# EAGLE schematic TechLab_Cape (EAGLE 7.7.0)
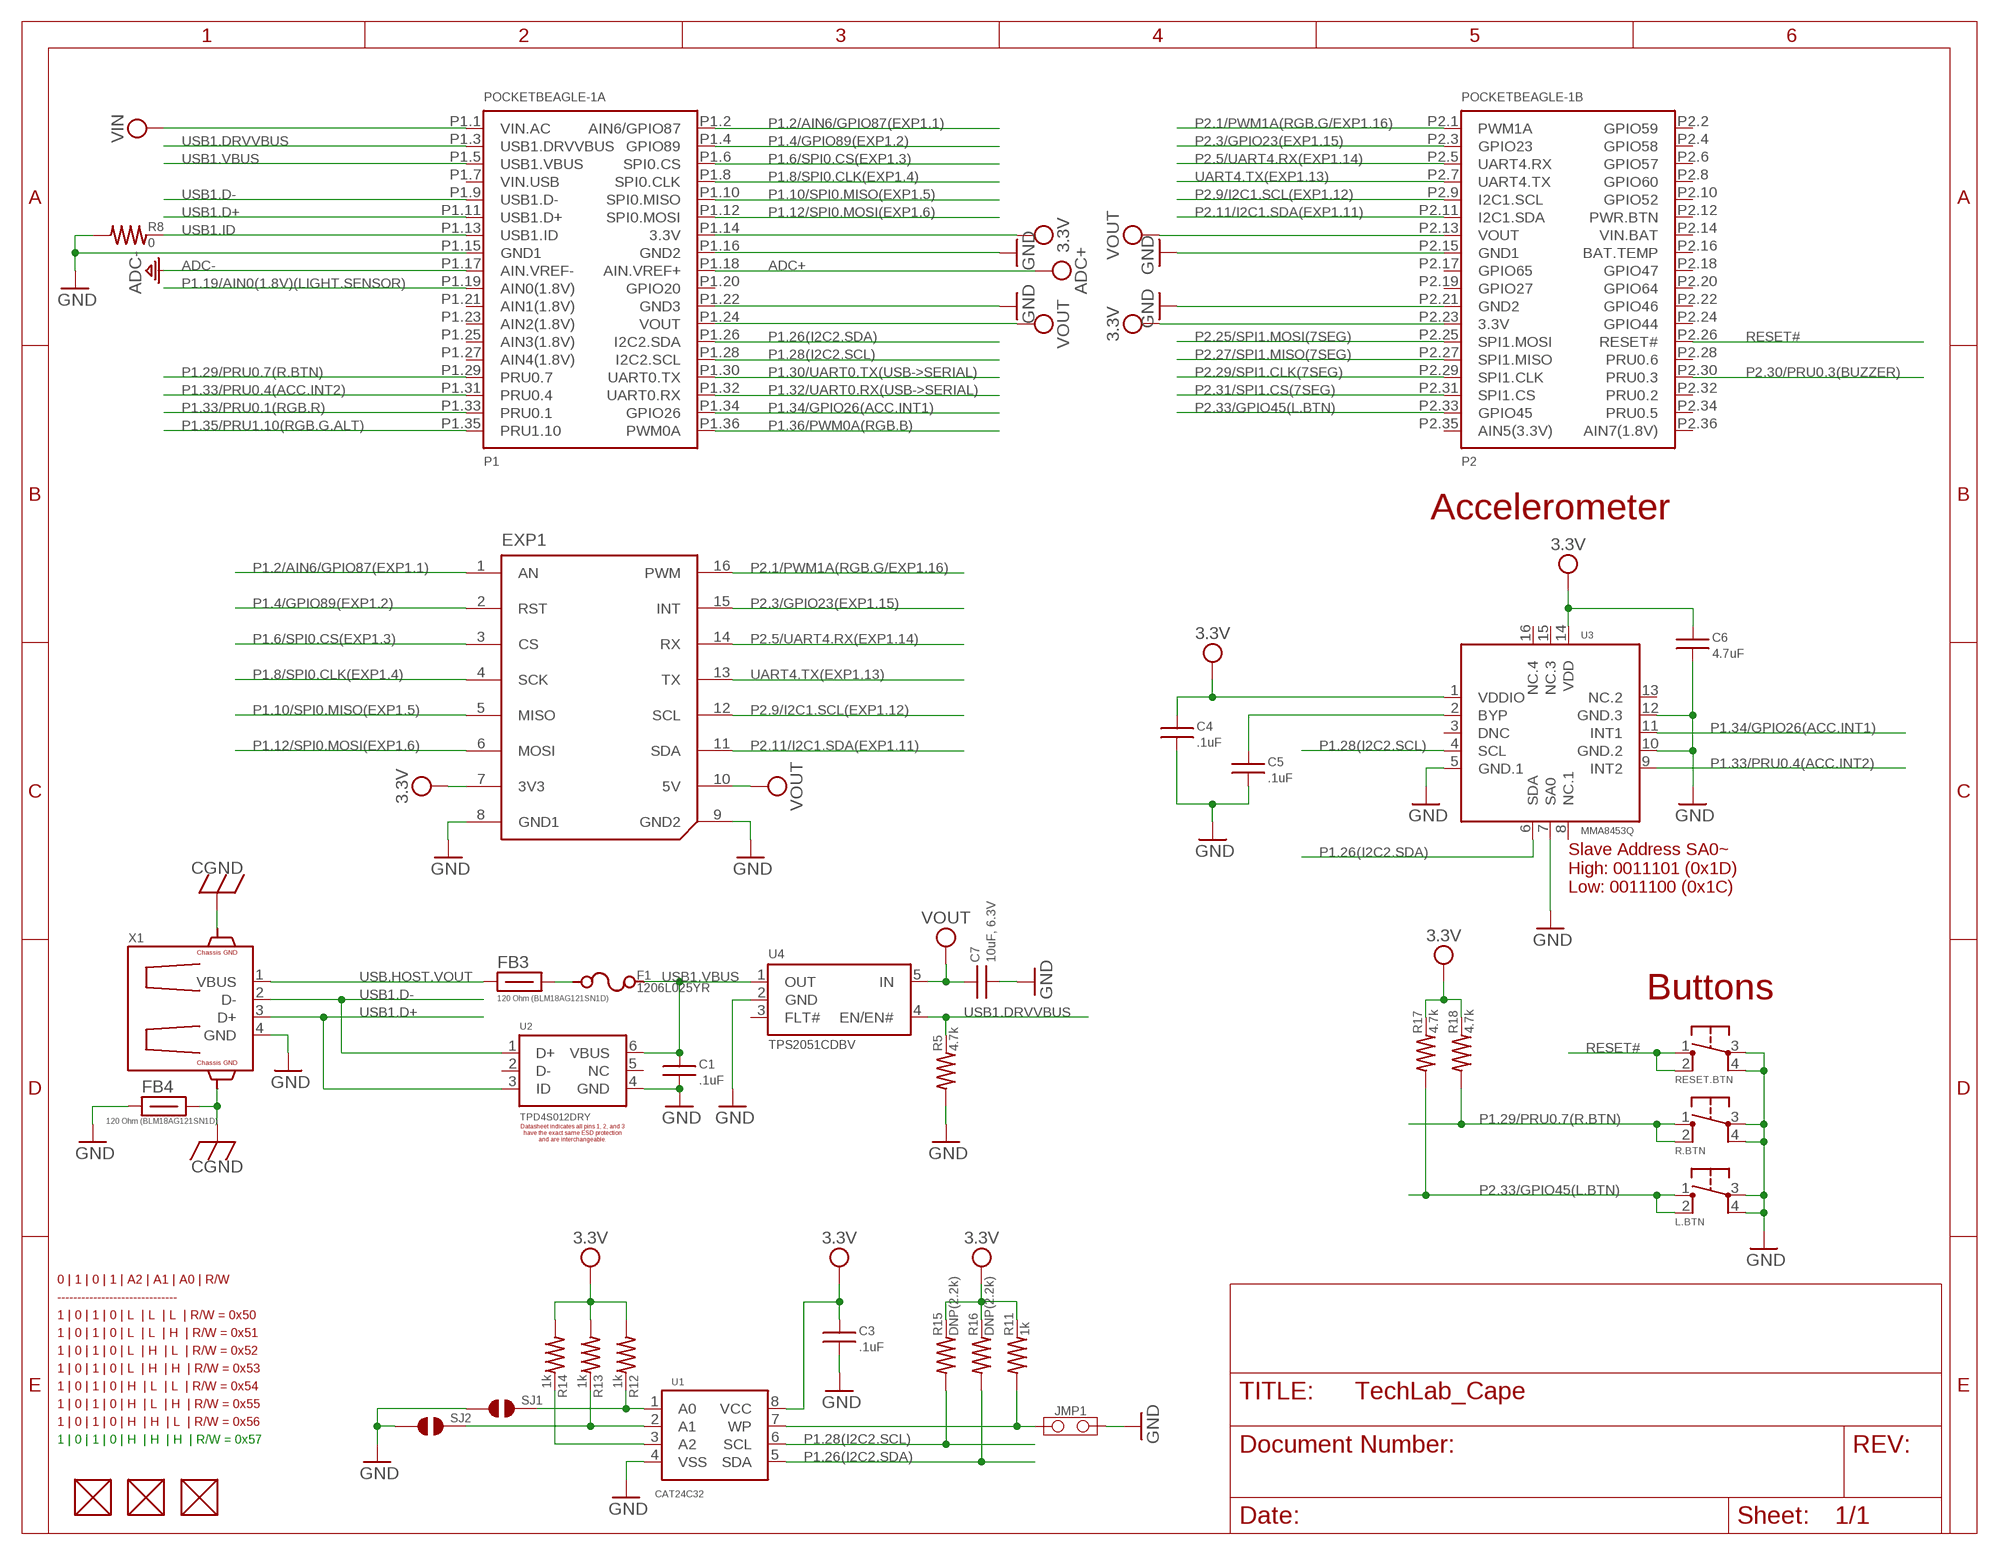
[diagram p0: schematic, sheet 1, part 1 of 2]
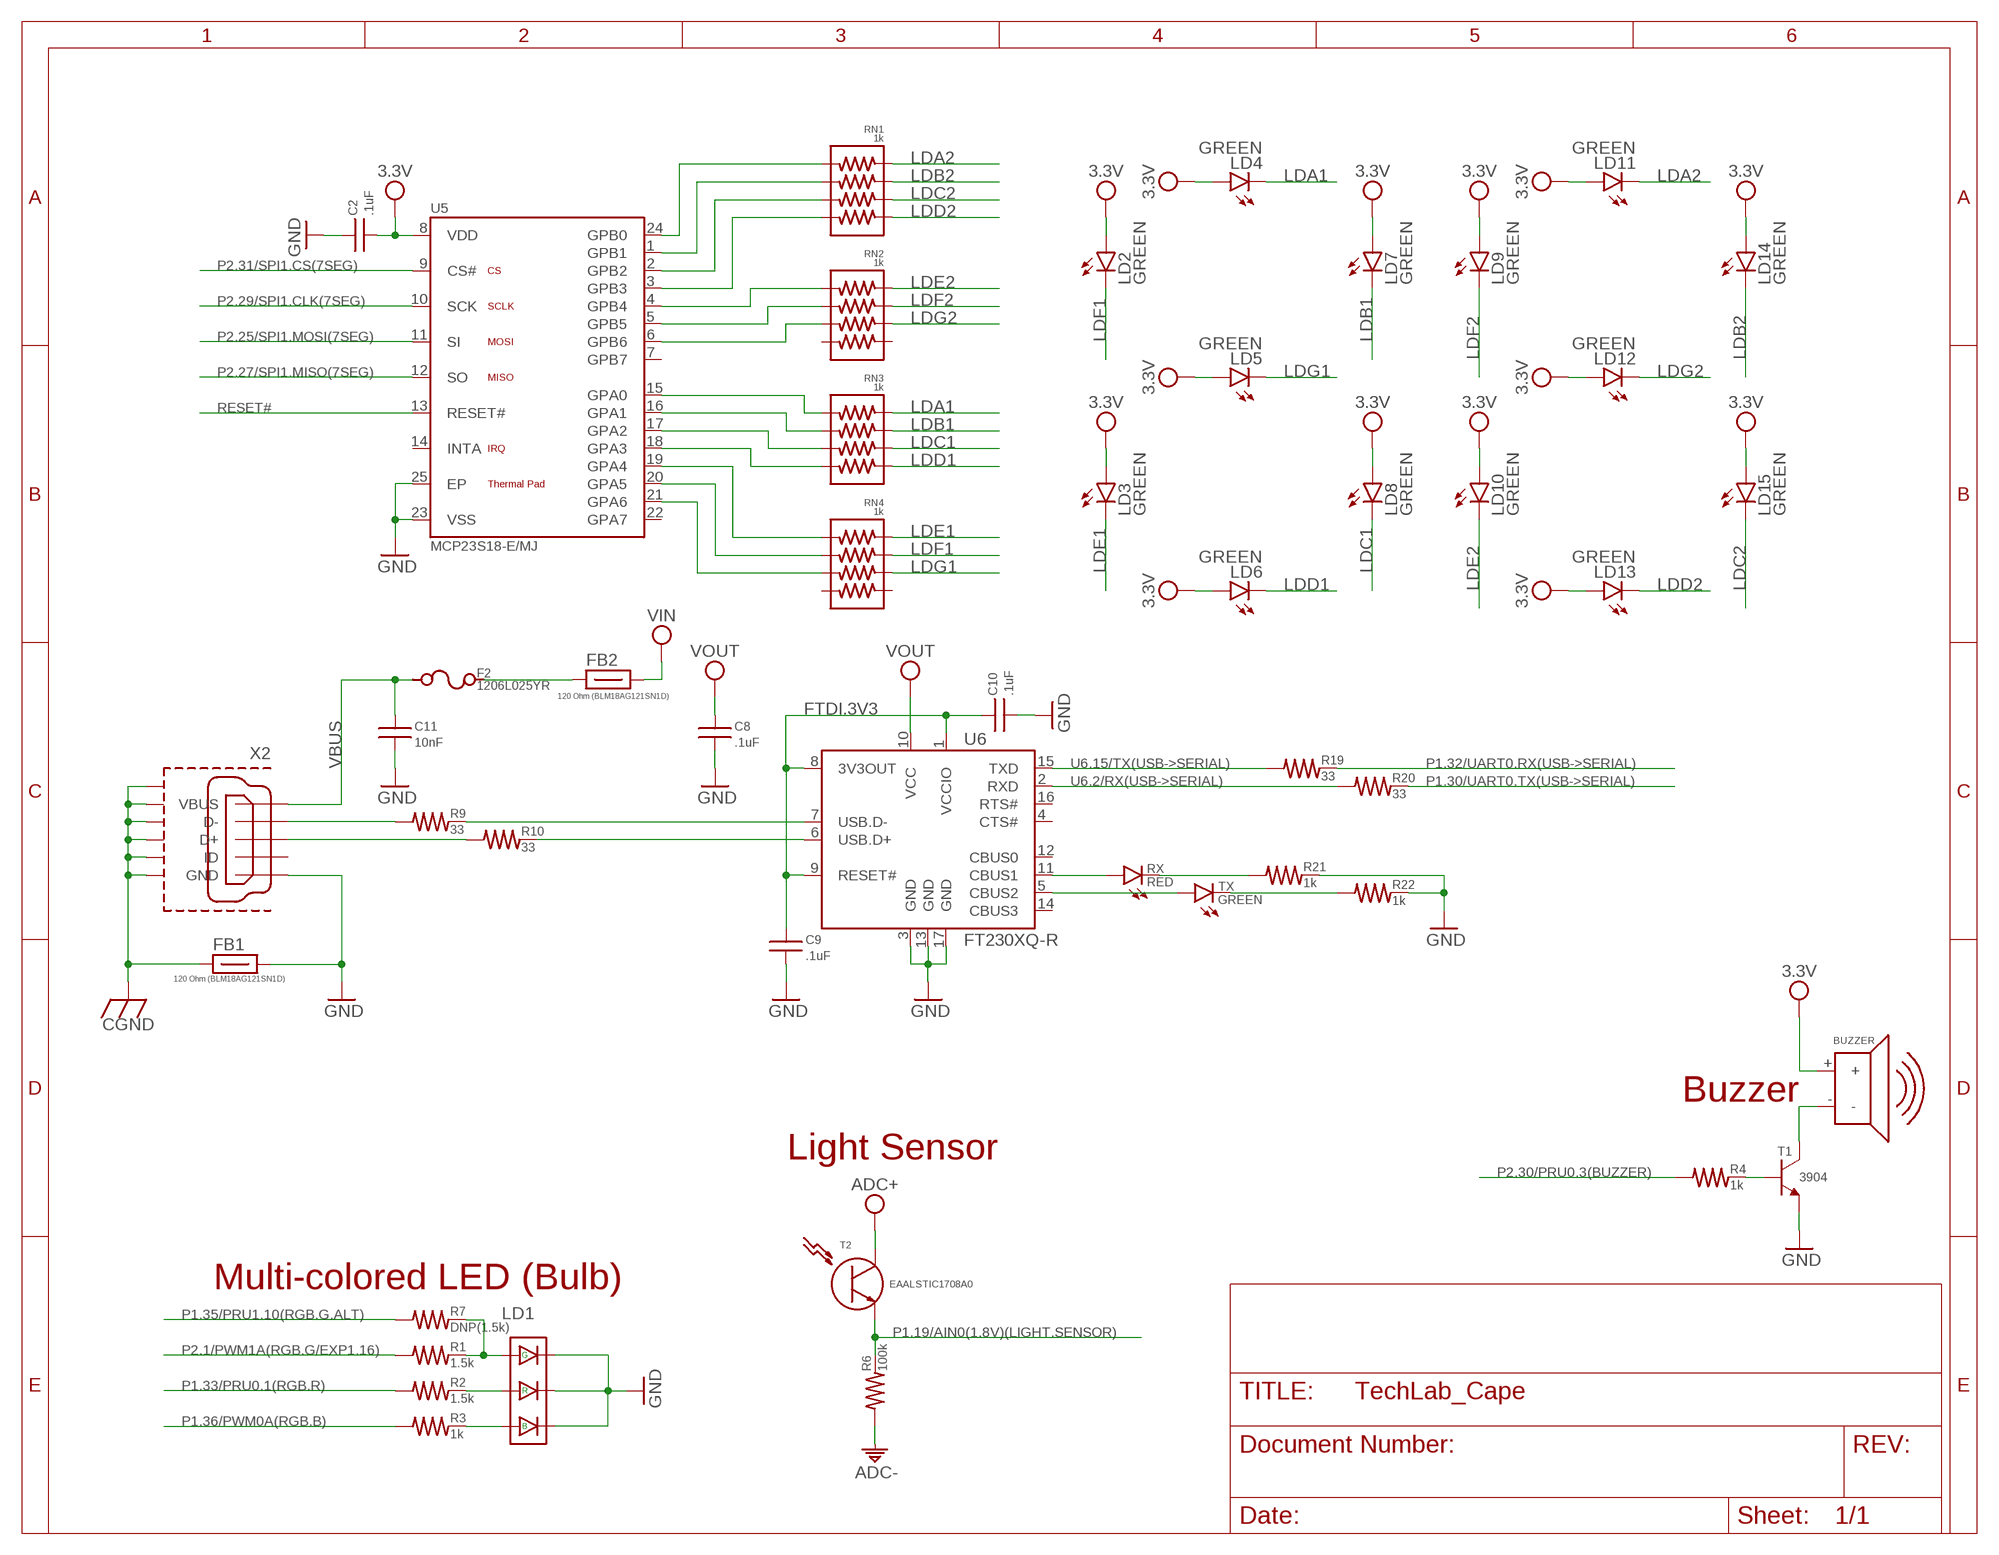
[diagram p1: schematic, sheet 1, part 2 of 2]

## Parts
BUZZER  SMD-140035H  [SMD-140035H]
C1  .1uF  CAPACITOR-(INCH)-0402  [0402]
C2  .1uF  CAPACITOR-(INCH)-0402  [0402]
C3  .1uF  CAPACITOR-(INCH)-0402  [0402]
C4  .1uF  CAPACITOR-(INCH)-0402  [0402]
C5  .1uF  CAPACITOR-(INCH)-0402  [0402]
C6  4.7uF  CAPACITOR-(INCH)-0402  [0402]
C7  10uF, 6.3V  CAPACITOR-(INCH)-0805  [0805]
C8  .1uF  CAPACITOR-(INCH)-0402  [0402]
C9  .1uF  CAPACITOR-(INCH)-0402  [0402]
C10  .1uF  CAPACITOR-(INCH)-0402  [0402]
C11  10nF  CAPACITOR-(INCH)-0402  [0402]
EXP1  PARALLEL-8PIN-0.9INCH_PITCH-SMT_GP  [PARALLEL-8PIN-0.9INCH_PITCH-SMT_GP]
F1  1206L025YR  FUSE-(INCH)-1206  [1206]
F2  1206L025YR  FUSE-(INCH)-1206  [1206]
FB1  120 Ohm (BLM18AG121SN1D)  FB-(INCH)-0603  [0603]
FB2  120 Ohm (BLM18AG121SN1D)  FB-(INCH)-0603  [0603]
FB3  120 Ohm (BLM18AG121SN1D)  FB-(INCH)-0603  [0603]
FB4  120 Ohm (BLM18AG121SN1D)  FB-(INCH)-0603  [0603]
FUD1  FIDUCIAL  [FIDUCIAL_40MIL]
FUD2  FIDUCIAL  [FIDUCIAL_40MIL]
FUD3  FIDUCIAL  [FIDUCIAL_40MIL]
JMP1  JUMPER-(X2)  [JUMPER-(X2)]
L.BTN  TACTILE.SWITCH-6MM  [6MM_TACTILE-SWITCH]
LD1  JNS-5050RGB  [LED_RGB_5050]
LD2  GREEN  LED-(INCH)-0805  [0805-LED]
LD3  GREEN  LED-(INCH)-0805  [0805-LED]
LD4  GREEN  LED-(INCH)-0805  [0805-LED]
LD5  GREEN  LED-(INCH)-0805  [0805-LED]
LD6  GREEN  LED-(INCH)-0805  [0805-LED]
LD7  GREEN  LED-(INCH)-0805  [0805-LED]
LD8  GREEN  LED-(INCH)-0805  [0805-LED]
LD9  GREEN  LED-(INCH)-0805  [0805-LED]
LD10  GREEN  LED-(INCH)-0805  [0805-LED]
LD11  GREEN  LED-(INCH)-0805  [0805-LED]
LD12  GREEN  LED-(INCH)-0805  [0805-LED]
LD13  GREEN  LED-(INCH)-0805  [0805-LED]
LD14  GREEN  LED-(INCH)-0805  [0805-LED]
LD15  GREEN  LED-(INCH)-0805  [0805-LED]
POCKETBEAGLE-1  POCKETBEAGLE-(ORIGIN-CENTER)-SMT.PADS(ONLY)-NO.RESTRICT  [POCKETBEAGLE-(ORIGIN-CENTER)-SMT.PADS(ONLY)-NO.RESTRICT]
R1  1.5k  RESISTOR-(INCH)-0402  [0402]
R2  1.5k  RESISTOR-(INCH)-0402  [0402]
R3  1k  RESISTOR-(INCH)-0402  [0402]
R4  1k  RESISTOR-(INCH)-0402  [0402]
R5  4.7k  RESISTOR-(INCH)-0402  [0402]
R6  100k  RESISTOR-(INCH)-0402  [0402]
R7  DNP(1.5k)  RESISTOR-(INCH)-0402  [0402]
R8  0  RESISTOR-(INCH)-0402  [0402]
R9  33  RESISTOR-(INCH)-0402  [0402]
R10  33  RESISTOR-(INCH)-0402  [0402]
R11  1k  RESISTOR-(INCH)-0402  [0402]
R12  1k  RESISTOR-(INCH)-0402  [0402]
R13  1k  RESISTOR-(INCH)-0402  [0402]
R14  1k  RESISTOR-(INCH)-0402  [0402]
R15  DNP(2.2k)  RESISTOR-(INCH)-0402  [0402]
R16  DNP(2.2k)  RESISTOR-(INCH)-0402  [0402]
R17  4.7k  RESISTOR-(INCH)-0402  [0402]
R18  4.7k  RESISTOR-(INCH)-0402  [0402]
R19  33  RESISTOR-(INCH)-0402  [0402]
R20  33  RESISTOR-(INCH)-0402  [0402]
R21  1k  RESISTOR-(INCH)-0402  [0402]
R22  1k  RESISTOR-(INCH)-0402  [0402]
R.BTN  TACTILE.SWITCH-6MM  [6MM_TACTILE-SWITCH]
RESET.BTN  TACTILE.SWITCH-3X3.5MM  [3X3.5MM-TACTILE-SWITCH]
RN1  1k  RESISTOR.NETWORK-(4)  [RN0804]
RN2  1k  RESISTOR.NETWORK-(4)  [RN0804]
RN3  1k  RESISTOR.NETWORK-(4)  [RN0804]
RN4  1k  RESISTOR.NETWORK-(4)  [RN0804]
RX  RED  LED-(INCH)-0805  [0805-LED]
SJ1  SOLDER.JOINT-(INCH)-0402  [SOLDER.JOINT(0402)]
SJ2  SOLDER.JOINT-(INCH)-0402  [SOLDER.JOINT(0402)]
T1  3904  NPN.BIPOLAR-(SOT23)  [SOT23]
T2  EAALSTIC1708A0  [EAALSTIC1708A0]
TX  GREEN  LED-(INCH)-0805  [0805-LED]
U1  CAT24C32  [UDFN8,2X3(ON-SEMI)]
U2  TPD4S012DRY  TPD4S012DRYR  [SON-6(TI)-DRY]
U3  MMA8453Q  [QFN-16-(MMA8453Q)]
U4  TPS2051CDBV  [SOT23-5(TI-DBV)]
U5  MCP23S18-E/MJ  MCP23S18  [QFN24-MJ-0.5-4X4MM]
U6  FT230XQ-R  FT230XQ  [QFN16-0.65-4X4MM]
X1  292303-1  [292303-1]
X2  10118192-0001LF  [10118192-0001LF(MICRO-USB-B-AMPHENOL-FCI)]

## Nets
3.3V: BUZZER.+ C2.2 C3.1 C4.1 C6.1 EXP1.7(3V3) LD2.A LD3.A LD4.A LD5.A LD6.A LD7.A LD8.A LD9.A LD10.A LD11.A LD12.A LD13.A LD14.A LD15.A POCKETBEAGLE-1.P1.14(A:3.3V) POCKETBEAGLE-1.P2.23(B:3.3V) R11.2 R12.1 R13.1 R14.1 R15.2 R16.2 R17.2 R18.2 U1.8(VCC) U3.1(VDDIO) U3.14(VDD) U5.8(VDD)
A0: R12.2 SJ1.2 U1.1(A0)
A1: R13.2 SJ2.2 U1.2(A1)
A2: R14.2 U1.3(A2)
ADC+: POCKETBEAGLE-1.P1.18(A:AIN.VREF+) T2.1(C)
ADC-: POCKETBEAGLE-1.P1.17(A:AIN.VREF-) R6.1
CGND: FB1.1 FB4.2 X1.C1(CG) X1.C2(CG) X2.CGND1(SGND1) X2.CGND2(SGND2) X2.CGND3(SGND3) X2.CGND4(SGND4) X2.CGND5(SGND5) X2.CGND6(SGND6)
F2-FB2: F2.2 FB2.1
FB4-F1: F1.1 FB3.2
FTDI.3V3: C9.1 C10.1 U6.1(VCCIO) U6.8(3V3OUT) U6.9(RESET#)
GND: C1.2 C2.1 C3.2 C4.2 C5.2 C6.2 C7.2 C8.2 C9.2 C10.2 C11.2 EXP1.8(GND1) EXP1.9(GND2) FB1.2 FB4.1 JMP1.2 L.BTN.3 L.BTN.4 LD1.4(-) LD1.5(-) LD1.6(-) POCKETBEAGLE-1.P1.15(A:GND1) POCKETBEAGLE-1.P1.16(A:GND2) POCKETBEAGLE-1.P1.22(A:GND3) POCKETBEAGLE-1.P2.15(B:GND1) POCKETBEAGLE-1.P2.21(B:GND2) R5.1 R8.1 R21.2 R22.2 R.BTN.3 R.BTN.4 RESET.BTN.3 RESET.BTN.4 SJ1.1 SJ2.1 T1.2(E) U1.4(VSS) U2.4(GND) U3.5(GND.1) U3.7(SA0) U3.10(GND.2) U3.12(GND.3) U4.2(GND) U5.23(VSS) U5.25(EP) U6.3(GND) U6.13(GND) U6.17(GND) X1.4(GND) X2.GND
GPA0: RN3.8 U5.15(GPA0)
GPA1: RN3.7 U5.16(GPA1)
GPA2: RN3.6 U5.17(GPA2)
GPA3: RN3.5 U5.18(GPA3)
GPA4: RN4.8 U5.19(GPA4)
GPA5: RN4.7 U5.20(GPA5)
GPA6: RN4.6 U5.21(GPA6)
GPB0: RN1.8 U5.24(GPB0)
GPB1: RN1.7 U5.1(GPB1)
GPB2: RN1.6 U5.2(GPB2)
GPB3: RN1.5 U5.3(GPB3)
GPB4: RN2.8 U5.4(GPB4)
GPB5: RN2.7 U5.5(GPB5)
GPB6: RN2.6 U5.6(GPB6)
LDA1: LD4.K RN3.1
LDA2: LD11.K RN1.1
LDB1: LD7.K RN3.2
LDB2: LD14.K RN1.2
LDC1: LD8.K RN3.3
LDC2: LD15.K RN1.3
LDD1: LD6.K RN3.4
LDD2: LD13.K RN1.4
LDE1: LD3.K RN4.1
LDE2: LD10.K RN2.1
LDF1: LD2.K RN4.2
LDF2: LD9.K RN2.2
LDG1: LD5.K RN4.3
LDG2: LD12.K RN2.3
LED.BLUE: LD1.1(+) R3.2
LED.GREEN: LD1.3(+) R1.2 R7.2
LED.RED: LD1.2(+) R2.2
N$5: BUZZER.- T1.3(C)
N$10: C5.1 U3.2(BYP)
N$51: R4.2 T1.1(B)
P1.2/AIN6/GPIO87(EXP1.1): EXP1.1(AN) POCKETBEAGLE-1.P1.2(A:AIN6/GPIO87)
P1.4/GPIO89(EXP1.2): EXP1.2(RST) POCKETBEAGLE-1.P1.4(A:GPIO89)
P1.6/SPI0.CS(EXP1.3): EXP1.3(CS) POCKETBEAGLE-1.P1.6(A:SPI0.CS)
P1.8/SPI0.CLK(EXP1.4): EXP1.4(SCK) POCKETBEAGLE-1.P1.8(A:SPI0.CLK)
P1.10/SPI0.MISO(EXP1.5): EXP1.5(MISO) POCKETBEAGLE-1.P1.10(A:SPI0.MISO)
P1.12/SPI0.MOSI(EXP1.6): EXP1.6(MOSI) POCKETBEAGLE-1.P1.12(A:SPI0.MOSI)
P1.19/AIN0(1.8V)(LIGHT.SENSOR): POCKETBEAGLE-1.P1.19(A:AIN0(1.8V)) R6.2 T2.2(E)
P1.26(I2C2.SDA): POCKETBEAGLE-1.P1.26(A:I2C2.SDA) R16.1 U1.5(SDA) U3.6(SDA)
P1.28(I2C2.SCL): POCKETBEAGLE-1.P1.28(A:I2C2.SCL) R15.1 U1.6(SCL) U3.4(SCL)
P1.29/PRU0.7(R.BTN): POCKETBEAGLE-1.P1.29(A:PRU0.7) R18.1 R.BTN.1 R.BTN.2
P1.30/UART0.TX(USB->SERIAL): POCKETBEAGLE-1.P1.30(A:UART0.TX) R20.2
P1.32/UART0.RX(USB->SERIAL): POCKETBEAGLE-1.P1.32(A:UART0.RX) R19.2
P1.33/PRU0.1(RGB.R): POCKETBEAGLE-1.P1.33(A:PRU0.1) R2.1
P1.33/PRU0.4(ACC.INT2): POCKETBEAGLE-1.P1.31(A:PRU0.4) U3.9(INT2)
P1.34/GPIO26(ACC.INT1): POCKETBEAGLE-1.P1.34(A:GPIO26) U3.11(INT1)
P1.35/PRU1.10(RGB.G.ALT): POCKETBEAGLE-1.P1.35(A:PRU1.10) R7.1
P1.36/PWM0A(RGB.B): POCKETBEAGLE-1.P1.36(A:PWM0A) R3.1
P2.1/PWM1A(RGB.G/EXP1.16): EXP1.16(PWM) POCKETBEAGLE-1.P2.1(B:PWM1A) R1.1
P2.3/GPIO23(EXP1.15): EXP1.15(INT) POCKETBEAGLE-1.P2.3(B:GPIO23)
P2.5/UART4.RX(EXP1.14): EXP1.14(RX) POCKETBEAGLE-1.P2.5(B:UART4.RX)
P2.9/I2C1.SCL(EXP1.12): EXP1.12(SCL) POCKETBEAGLE-1.P2.9(B:I2C1.SCL)
P2.11/I2C1.SDA(EXP1.11): EXP1.11(SDA) POCKETBEAGLE-1.P2.11(B:I2C1.SDA)
P2.25/SPI1.MOSI(7SEG): POCKETBEAGLE-1.P2.25(B:SPI1.MOSI) U5.11(SI)
P2.27/SPI1.MISO(7SEG): POCKETBEAGLE-1.P2.27(B:SPI1.MISO) U5.12(SO)
P2.29/SPI1.CLK(7SEG): POCKETBEAGLE-1.P2.29(B:SPI1.CLK) U5.10(SCK)
P2.30/PRU0.3(BUZZER): POCKETBEAGLE-1.P2.30(B:PRU0.3) R4.1
P2.31/SPI1.CS(7SEG): POCKETBEAGLE-1.P2.31(B:SPI1.CS) U5.9(CS#)
P2.33/GPIO45(L.BTN): L.BTN.1 L.BTN.2 POCKETBEAGLE-1.P2.33(B:GPIO45) R17.1
RESET#: POCKETBEAGLE-1.P2.26(B:RESET#) RESET.BTN.1 RESET.BTN.2 U5.13(RESET#)
RX->R21: R21.1 RX.K
TX->R22: R22.1 TX.K
U6.2/RX(USB->SERIAL): R20.1 U6.2(RXD)
U6.5->TX: TX.A U6.5(CBUS2)
U6.11->RX: RX.A U6.11(CBUS1)
U6.15/TX(USB->SERIAL): R19.1 U6.15(TXD)
UART4.TX(EXP1.13): EXP1.13(TX) POCKETBEAGLE-1.P2.7(B:UART4.TX)
UD+: R10.2 U6.6(USB.D+)
UD-: R9.2 U6.7(USB.D-)
USB1.D+: POCKETBEAGLE-1.P1.11(A:USB1.D+) U2.3(ID) X1.3(D+)
USB1.D-: POCKETBEAGLE-1.P1.9(A:USB1.D-) U2.1(D+) X1.2(D-)
USB1.DRVVBUS: POCKETBEAGLE-1.P1.3(A:USB1.DRVVBUS) R5.2 U4.4(EN/EN#)
USB1.ID: POCKETBEAGLE-1.P1.13(A:USB1.ID) R8.2
USB1.VBUS: C1.1 F1.2 POCKETBEAGLE-1.P1.5(A:USB1.VBUS) U2.6(VBUS) U4.1(OUT)
USB.HOST.VOUT: FB3.1 X1.1(VBUS)
VBUS: C11.1 F2.1 X2.VBUS
VIN: FB2.2 POCKETBEAGLE-1.P1.1(A:VIN.AC)
VOUT: C7.1 C8.1 EXP1.10(5V) POCKETBEAGLE-1.P1.24(A:VOUT) POCKETBEAGLE-1.P2.13(B:VOUT) U4.5(IN) U6.10(VCC)
WP: JMP1.1 R11.1 U1.7(WP)
XD+: R10.1 X2.D+
XD-: R9.1 X2.D-
Unconnected: FUD1.P$1 FUD2.P$1 FUD3.P$1 POCKETBEAGLE-1.P1.7(A:VIN.USB) POCKETBEAGLE-1.P1.20(A:GPIO20) POCKETBEAGLE-1.P1.21(A:AIN1(1.8V)) POCKETBEAGLE-1.P1.23(A:AIN2(1.8V)) POCKETBEAGLE-1.P1.25(A:AIN3(1.8V)) POCKETBEAGLE-1.P1.27(A:AIN4(1.8V)) POCKETBEAGLE-1.P2.2(B:GPIO59) POCKETBEAGLE-1.P2.4(B:GPIO58) POCKETBEAGLE-1.P2.6(B:GPIO57) POCKETBEAGLE-1.P2.8(B:GPIO60) POCKETBEAGLE-1.P2.10(B:GPIO52) POCKETBEAGLE-1.P2.12(B:PWR.BTN) POCKETBEAGLE-1.P2.14(B:VIN.BAT) POCKETBEAGLE-1.P2.16(B:BAT.TEMP) POCKETBEAGLE-1.P2.17(B:GPIO65) POCKETBEAGLE-1.P2.18(B:GPIO47) POCKETBEAGLE-1.P2.19(B:GPIO27) POCKETBEAGLE-1.P2.20(B:GPIO64) POCKETBEAGLE-1.P2.22(B:GPIO46) POCKETBEAGLE-1.P2.24(B:GPIO44) POCKETBEAGLE-1.P2.28(B:PRU0.6) POCKETBEAGLE-1.P2.32(B:PRU0.2) POCKETBEAGLE-1.P2.34(B:PRU0.5) POCKETBEAGLE-1.P2.35(B:AIN5(3.3V)) POCKETBEAGLE-1.P2.36(B:AIN7(1.8V)) RN2.4 RN2.5 RN4.4 RN4.5 U2.2(D-) U2.5(NC) U3.3(DNC) U3.8(NC.1) U3.13(NC.2) U3.15(NC.3) U3.16(NC.4) U4.3(FLT#) U5.7(GPB7) U5.14(INTA) U5.22(GPA7) U6.4(CTS#) U6.12(CBUS0) U6.14(CBUS3) U6.16(RTS#) X2.ID

## Notes on the sheet
- Accelerometer
- Slave Address SA0~
  High: 0011101 (0x1D)
  Low: 0011100 (0x1C)
- Buttons
- Buzzer
- Datasheet indicates all pins 1, 2, and 3
  have the exact same ESD protection
  and are interchangeable.
- Light Sensor
- 0 | 1 | 0 | 1 | A2 | A1 | A0 | R/W
- Multi-colored LED (Bulb)
- ------------------------------
- 1 | 0 | 1 | 0 | L  | L  | L  | R/W = 0x50
- 1 | 0 | 1 | 0 | L  | L  | H  | R/W = 0x51
- 1 | 0 | 1 | 0 | L  | H  | L  | R/W = 0x52
- 1 | 0 | 1 | 0 | L  | H  | H  | R/W = 0x53
- 1 | 0 | 1 | 0 | H  | L  | L  | R/W = 0x54
- 1 | 0 | 1 | 0 | H  | L  | H  | R/W = 0x55
- 1 | 0 | 1 | 0 | H  | H  | L  | R/W = 0x56
- 1 | 0 | 1 | 0 | H  | H  | H  | R/W = 0x57

## Library data of the parts
BUZZER = GHI-IOComponents:SMD-140035H: 11x14 mm four pin square piezo
C1-C11 = GHI-BasicComponents:CAPACITOR-(INCH)-: Basic SMD ceramic capacitors
EXP1 = GHI-Headers:PARALLEL-8PIN-0.9INCH_PITCH-SMT: Dual Parallel 8pin female surface mount headers spaced by 0.9 inch pitch.
F1 F2 = GHI-BasicComponents:FUSE-(INCH)-
FB1-FB4 = GHI-BasicComponents:FB-(INCH)-
FUD1-FUD3 = GHI:FIDUCIAL
JMP1 = GHI-Headers:JUMPER-(X2)
L.BTN R.BTN RESET.BTN = GHI-IOComponents:TACTILE.SWITCH-: 4 Lead Tactile Push Button Switches
LD1 = GHI2:JNS-5050RGB
LD2-LD15 RX TX = GHI-BasicComponents:LED-(INCH)-: Basic SMD LEDs
POCKETBEAGLE-1 = GHI-Solutions:POCKETBEAGLE
R1-R22 = GHI-BasicComponents:RESISTOR-(INCH)-: Basic SMD Resistors
RN1-RN4 = GHI-BasicComponents:RESISTOR.NETWORK-(4)
SJ1 SJ2 = GHI-Miscellaneous:SOLDER.JOINT-(INCH)-: Solder Joint (Bridge) Pads - For easy solder joining.
T1 = GHI-Transistors:NPN.BIPOLAR-: NPN TRANSISTOR
T2 = GHI-Transistors:EAALSTIC1708A0: Light Ambient Sensor - Surface Mount
U1 = GHI-IC:CAT24C32: 32-Kb I2C CMOS Serial EEPROM
U2 = GHI-IC:TPD4S012DRYR
U3 = GHI-IC:MMA8453Q
U4 = GHI-IC:TPS2051CDBV: TPS20xxC and TPS20xxC-2 Current Limited, Power-Distribution Switches from TI
U5 = GHI-IC:MCP23S18: SPI BUS 16-Bit I/O Expander with Open-Drain Outputs from Microchip
U6 = GHI-IC:FT230XQ: USB to BASIC UART IC by FTDI (Future Technology Devices International)
X1 = GHI-Connectors:292303-1: Type A USB receptacle
X2 = GHI-Connectors:10118192-0001LF: Amphenol FCI Micro USB Type B Complete Surface Mount (SMT) no guide holes